# Altium schematic sheet ADC.SchDoc
size A4; Organization: Altium Limited; Address1: L3, 12a Rodborough Rd; Address2: Frenchs Forest; Address3: NSW; Address4: Australia 2086; DocumentNumber: 10; SheetNumber: 10; SheetTotal: 11
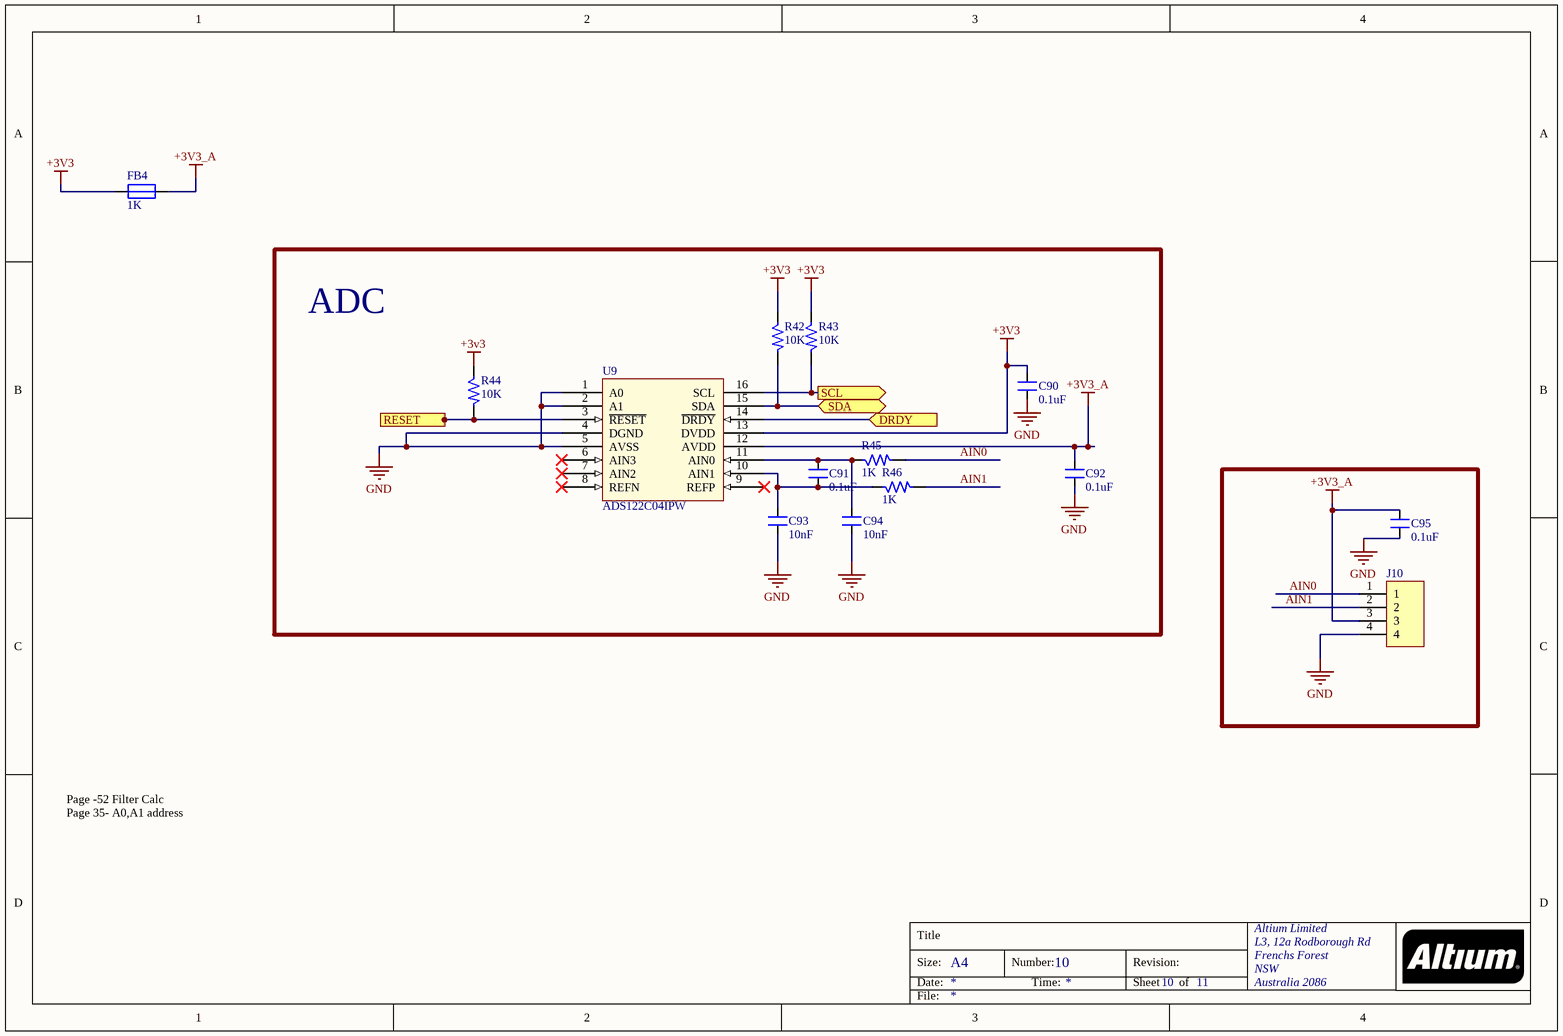
[diagram p0: ADC.SchDoc]

## Parts
C90  0.1uF  [CAP_0805]
C91  0.1uF  [CAP_0805]
C92  0.1uF  [CAP_0805]
C93  10nF  [CAP_0805]
C94  10nF  [CAP_0805]
C95  0.1uF  [CAP_0805]
FB4  1K  [IND_0805]
J10  1.25MM Spade 4PIN  [CON4_50_653004117322_TH_RA]  (value not drawn)
R42  10K  [RES_0805]
R43  10K  [RES_0805]
R44  10K  [RES_0805]
R45  1K  [RES_0805]
R46  1K  [RES_0805]
U9  ADS122C04IPW  [TSSOP16_25-59_294_54X14_SMT]

## Blocks framed on the sheet
ADC: C90-C94 R42-R46 U9

## Ports
DRDY (in), RESET (in), SCL (out), SDA (bidir)

## Nets
+3V3: C90.2 FB4.1 R42.1 R43.1 R44.1 U9.13(DVDD)
+3V3_A: C92.2 C95.2 FB4.2 J10.3 U9.12(AVDD)
GND: C90.1 C92.1 C93.2 C94.2 C95.1 J10.4 U9.1(A0) U9.2(A1) U9.4(DGND) U9.5(AVSS)
AIN0: J10.1 R45.2
AIN1: J10.2 R46.2
DRDY: U9.14(~{DRDY}) ; port DRDY
RESET: R44.2 U9.3(~{RESET}) ; port RESET
SCL: R43.2 U9.16(SCL) ; port SCL
SDA: R42.2 U9.15(SDA) ; port SDA
NetC91_1: C91.1 C94.1 R45.1 U9.11(AIN0)
NetC91_2: C91.2 C93.1 R46.1 U9.10(AIN1)

Not connected (* = marked no-connect by the designer): U9 6(AIN3)* 7(AIN2)* 8(REFN)* 9(REFP)*

## Notes on the sheet
- Page -52 Filter Calc
  Page 35- A0,A1 address
- Title
- Size:
- Date:
- A4
- Number:
- Time:
- Revision:
- Sheet
- of
- File:

## Library data of the parts
C90-C92 C95 = CAP_0.1uF-50V-5%-0805: 0.1µF ±5% 50V Ceramic Capacitor X7R 0805 (2012 Metric); Manufacturer: AVX Corporation; Manufacturer Part Number: 08055C104JAT4A; Alternate Part Number-1: 0805B104M500; Case/Package: 0805; Supplier-1: SIRICOM; Supplier Part Number-1: 0805B104J500CT
C93 C94 = CAP_10nF-50V-10%-0805: 10000pF ±10% 50V Ceramic Capacitor X7R 0805 (2012 Metric); Manufacturer: Samsung; Manufacturer Part Number: C0805C103K5RECAUTO; Alternate Part Number-1: GRM2195C1H103JA01D; Case/Package: 0805; Supplier-1: SIRICOM; Supplier Part Number-1: 0805B103K500CT
FB4 = FB_1K-100MHZ-1.6A-0805: 1 kOhms @ 100MHz 1 Power Line Ferrite Bead 0805 (2012 Metric) 1.6A; Manufacturer: Laird; Manufacturer Part Number: BLM21SP102SH1D; Alternate Part Number-1: NA; Case/Package: 0805; Supplier-1: SIRICOM; Supplier Part Number-1: ACMS201209A102
J10 = CON-PLG_4X1-50-RA-TH: 4 Pins, 1 Row 1.25mm Pitch, right angle Connector, male; Manufacturer Part Number: 653004117322; Manufacturer: JST; Mating Part Number: 653004113322; Crimp Part Number: 653153128130; Alternate Part Number-1: NA; Case/Package: TH-CON; Supplier-1: WURTH; Supplier Part Number-1: 653004117322
R42-R44 = RES_10K-0.125W-1%-0805: 10 kOhms ±1% 0.125W, 1/8W Chip Resistor 0805 (2012 Metric) Automotive AEC-Q200 Thick Film; Manufacturer: CTS; Manufacturer Part Number: WR08X1002FTL; Case/Package: 0805; Supplier-1: SIRICOM; Supplier Part Number-1: WR08X1002FTL; Alternate Part Number-1: WR08X1002FTL
R45 R46 = RES_1K-0.125W-1%-0805: 1 kOhms ±1% 0.125W, 1/8W Chip Resistor 0805 (2012 Metric) Moisture Resistant Thick Film; Manufacturer: Walsin; Manufacturer Part Number: WR08X1001FTL; Case/Package: 0805; Supplier-1: SP ROAD; Supplier Part Number-1: RC0805JR-071KL; Alternate Part Number-1: WR08X1001FTL
U9 = IC_ADS122C04IPW: 24 Bit Analog to Digital Converter 4 Input 1 Sigma-Delta 16-TSSOP; Manufacturer: Texas Instruments; Alternate Part Number-1: NA; Manufacturer Part Number: ADS122C04IPW; Case/Package: TSSOP16; Supplier-1: MOUSER; Supplier Part Number-1: ADS122C04IPW